# Altium schematic sheet Schematic.SchDoc
size A0; SheetNumber: 1; SheetTotal: 1
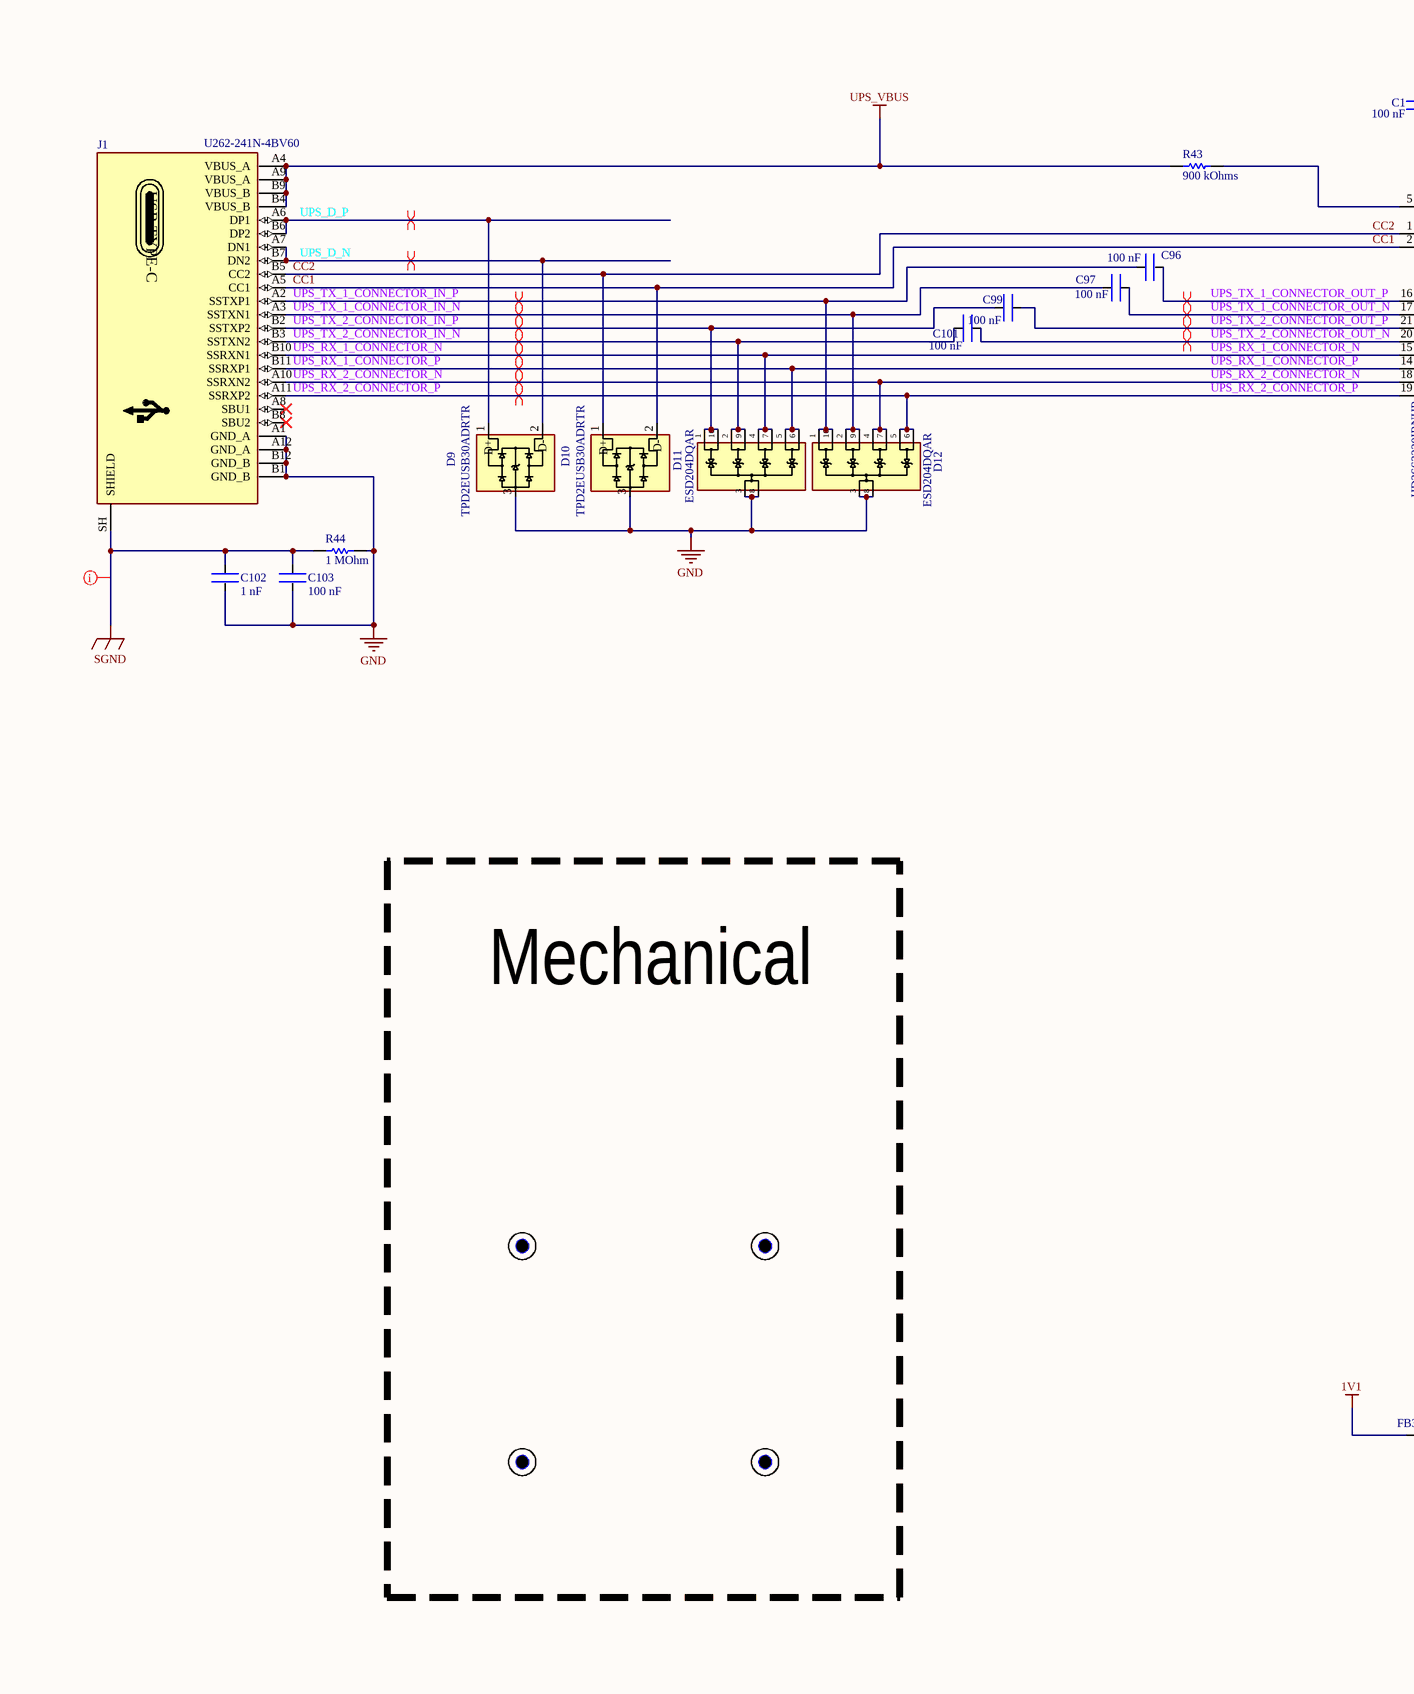
[diagram p0: Schematic.SchDoc, top left]
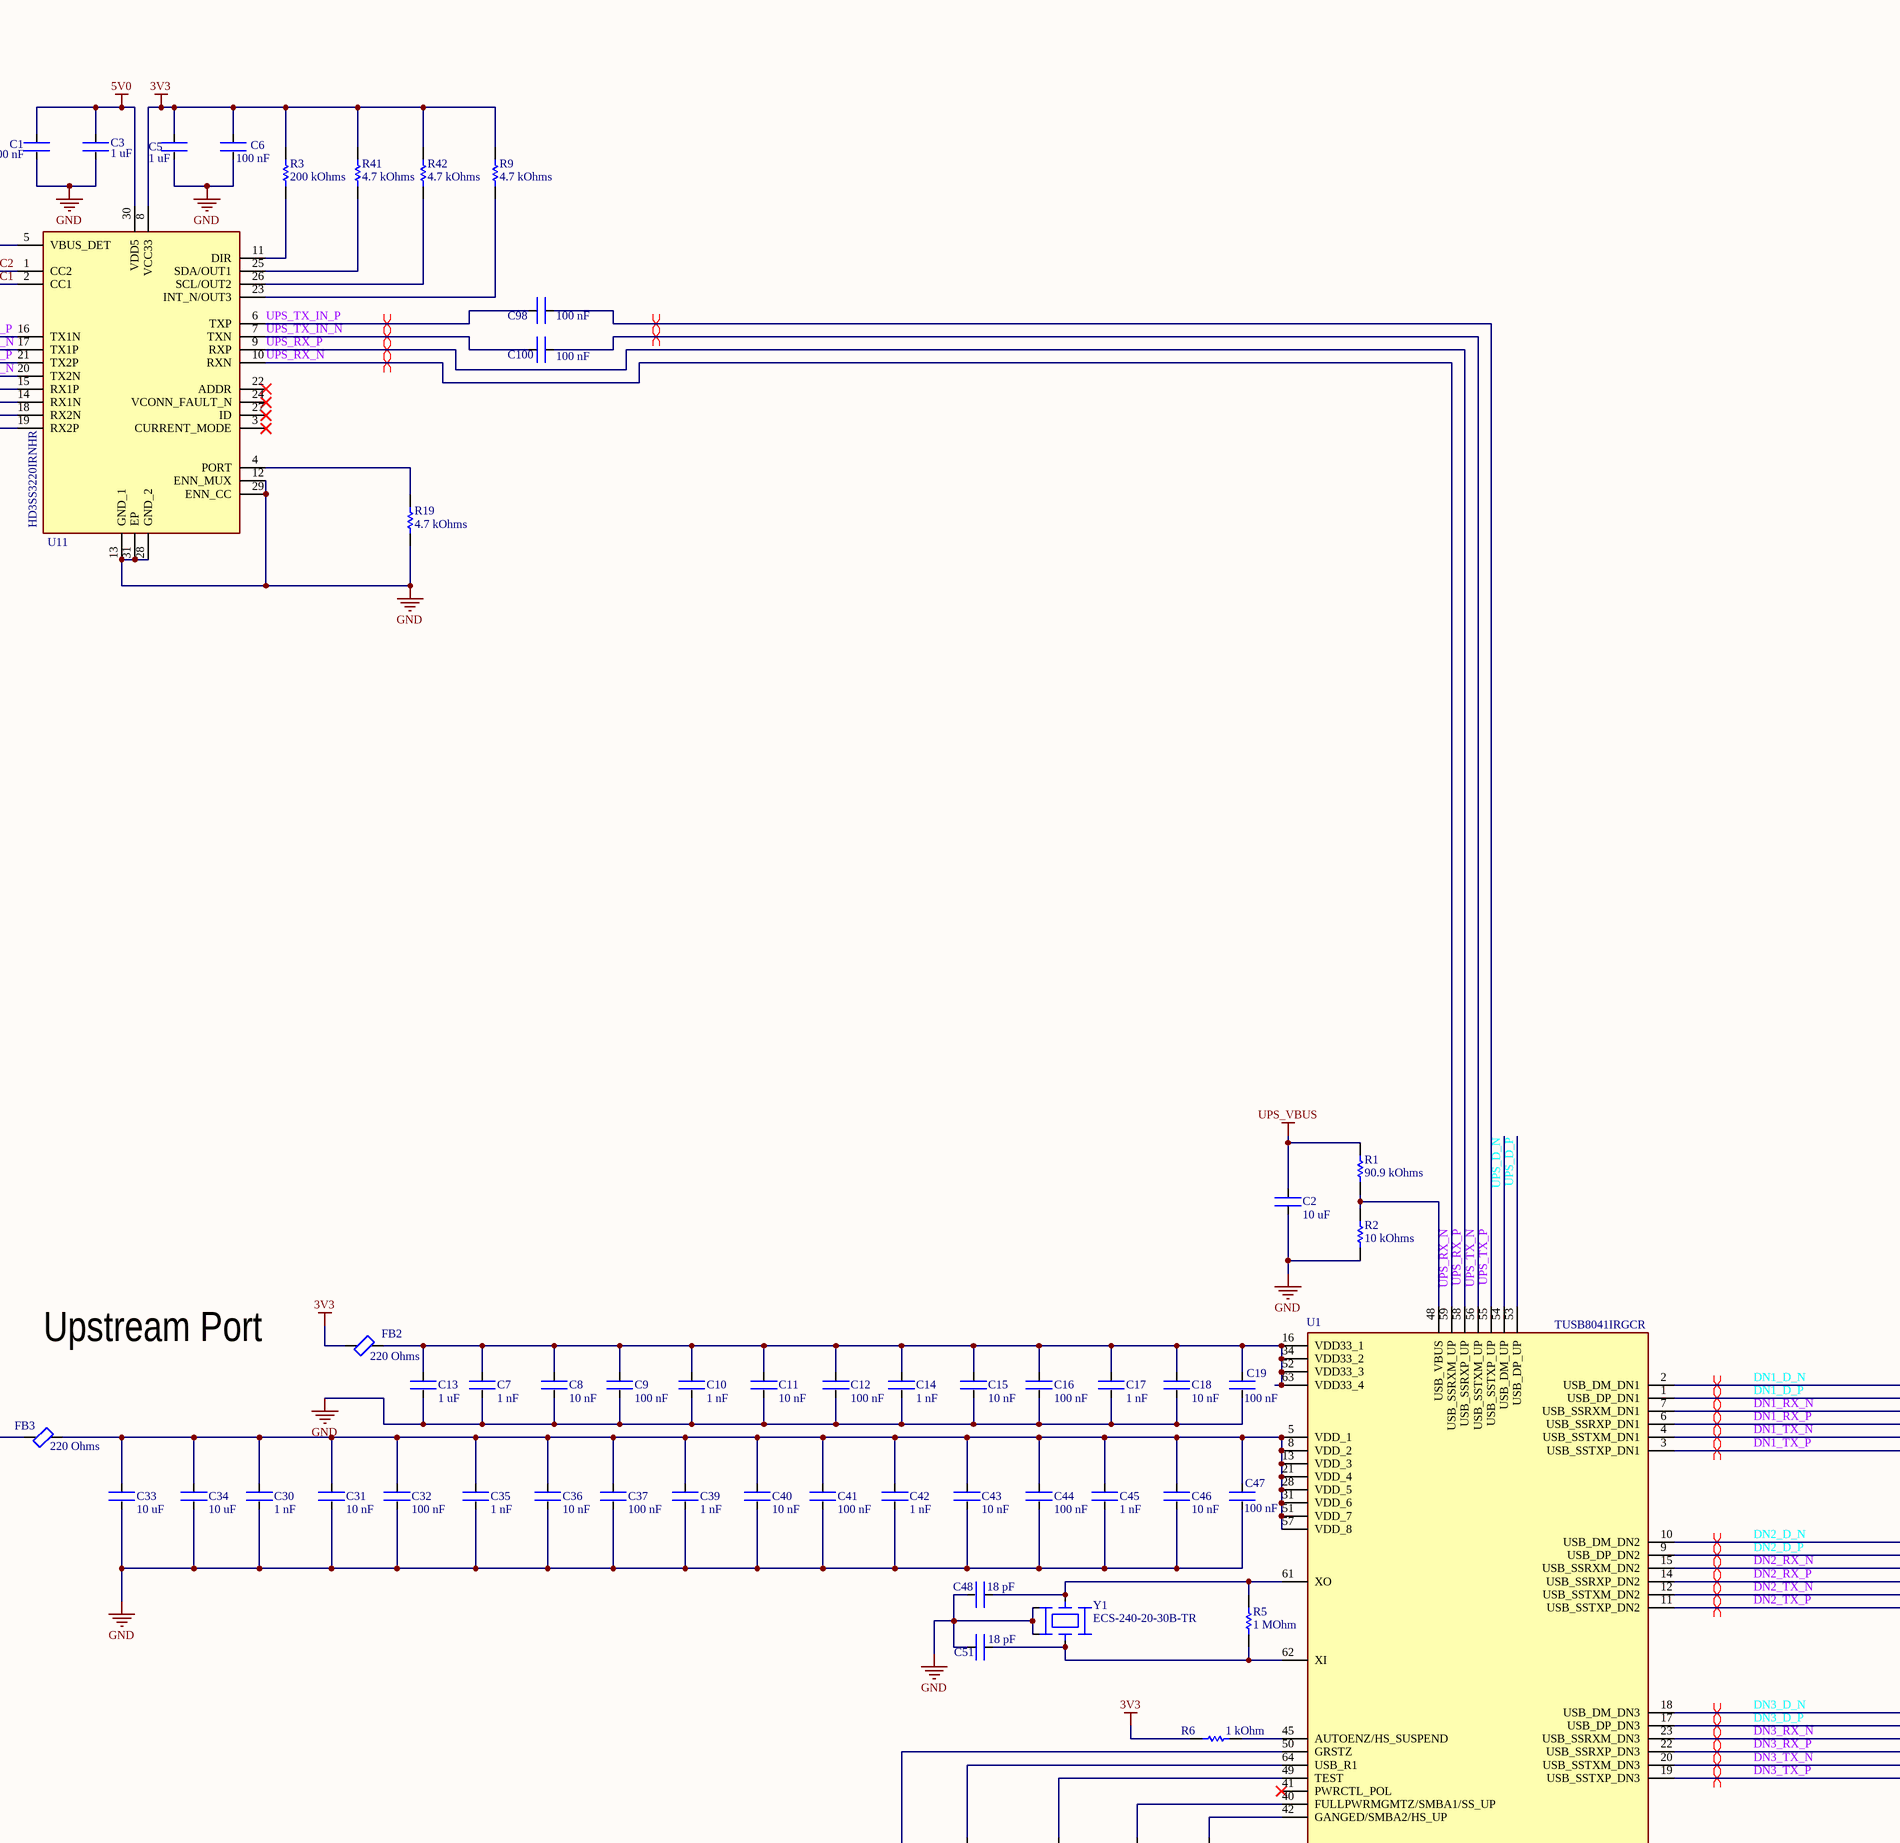
[diagram p1: Schematic.SchDoc, top middle]
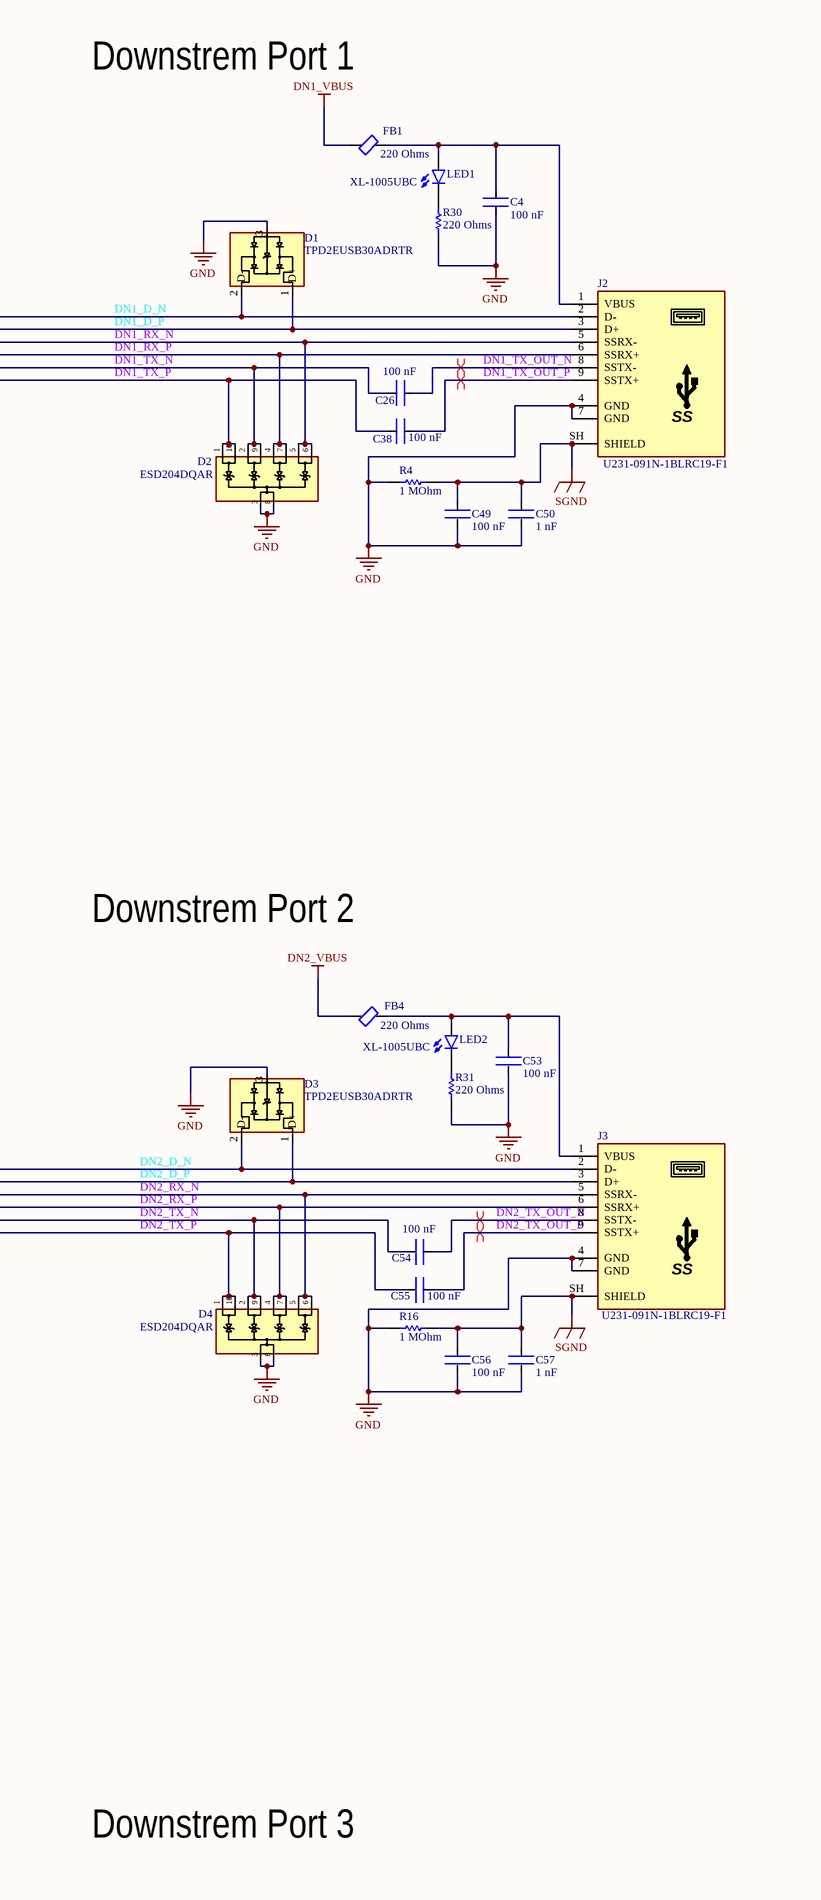
[diagram p2: Schematic.SchDoc, top right]
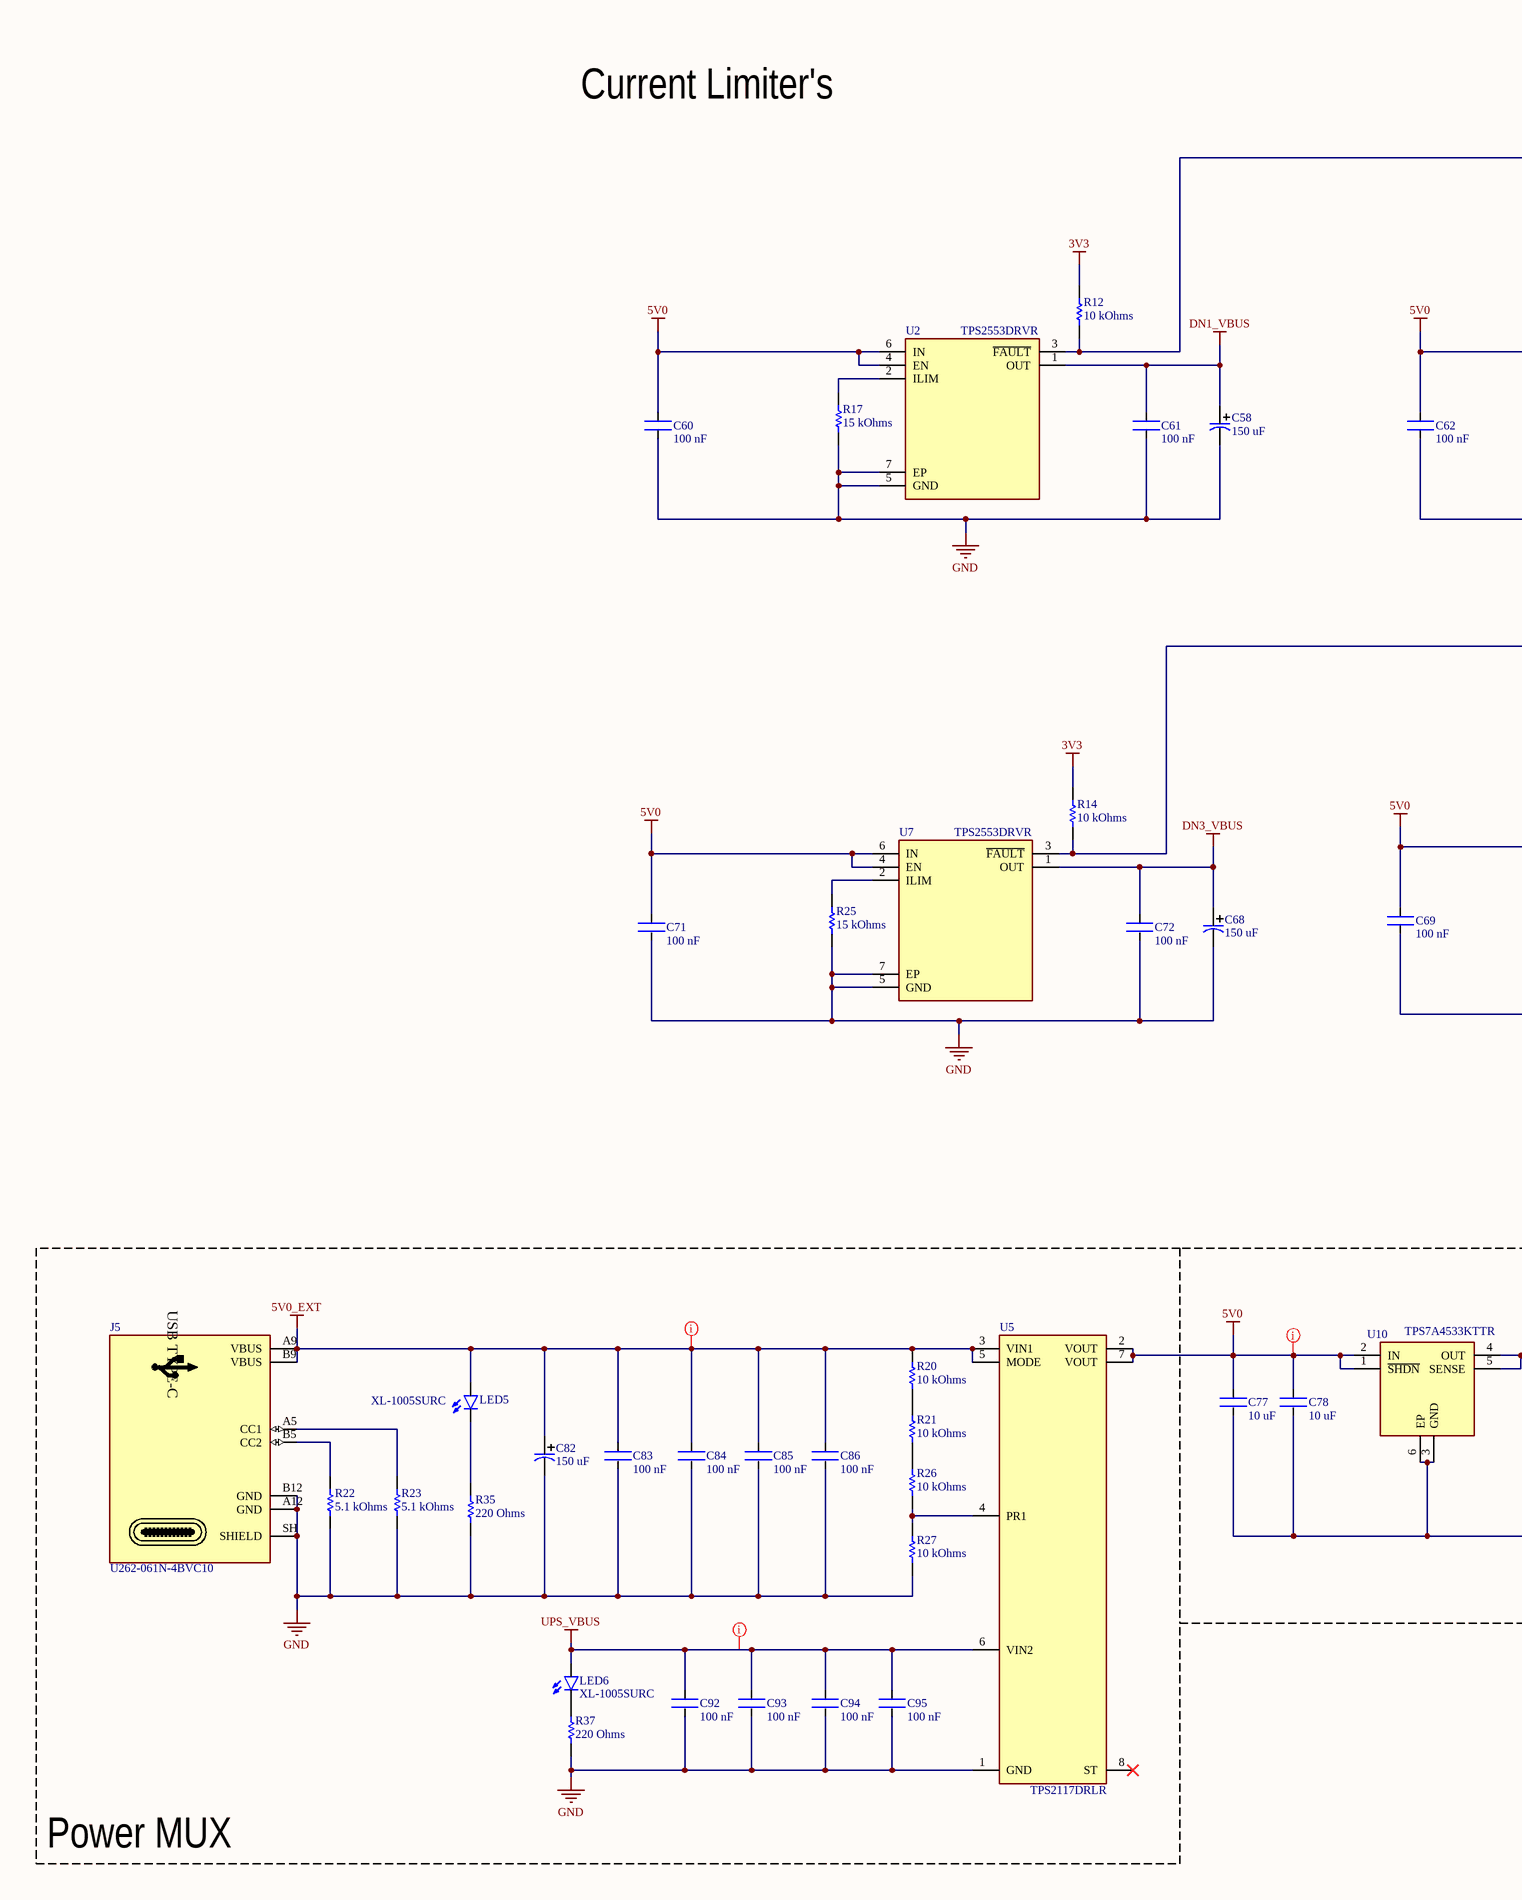
[diagram p3: Schematic.SchDoc, bottom left]
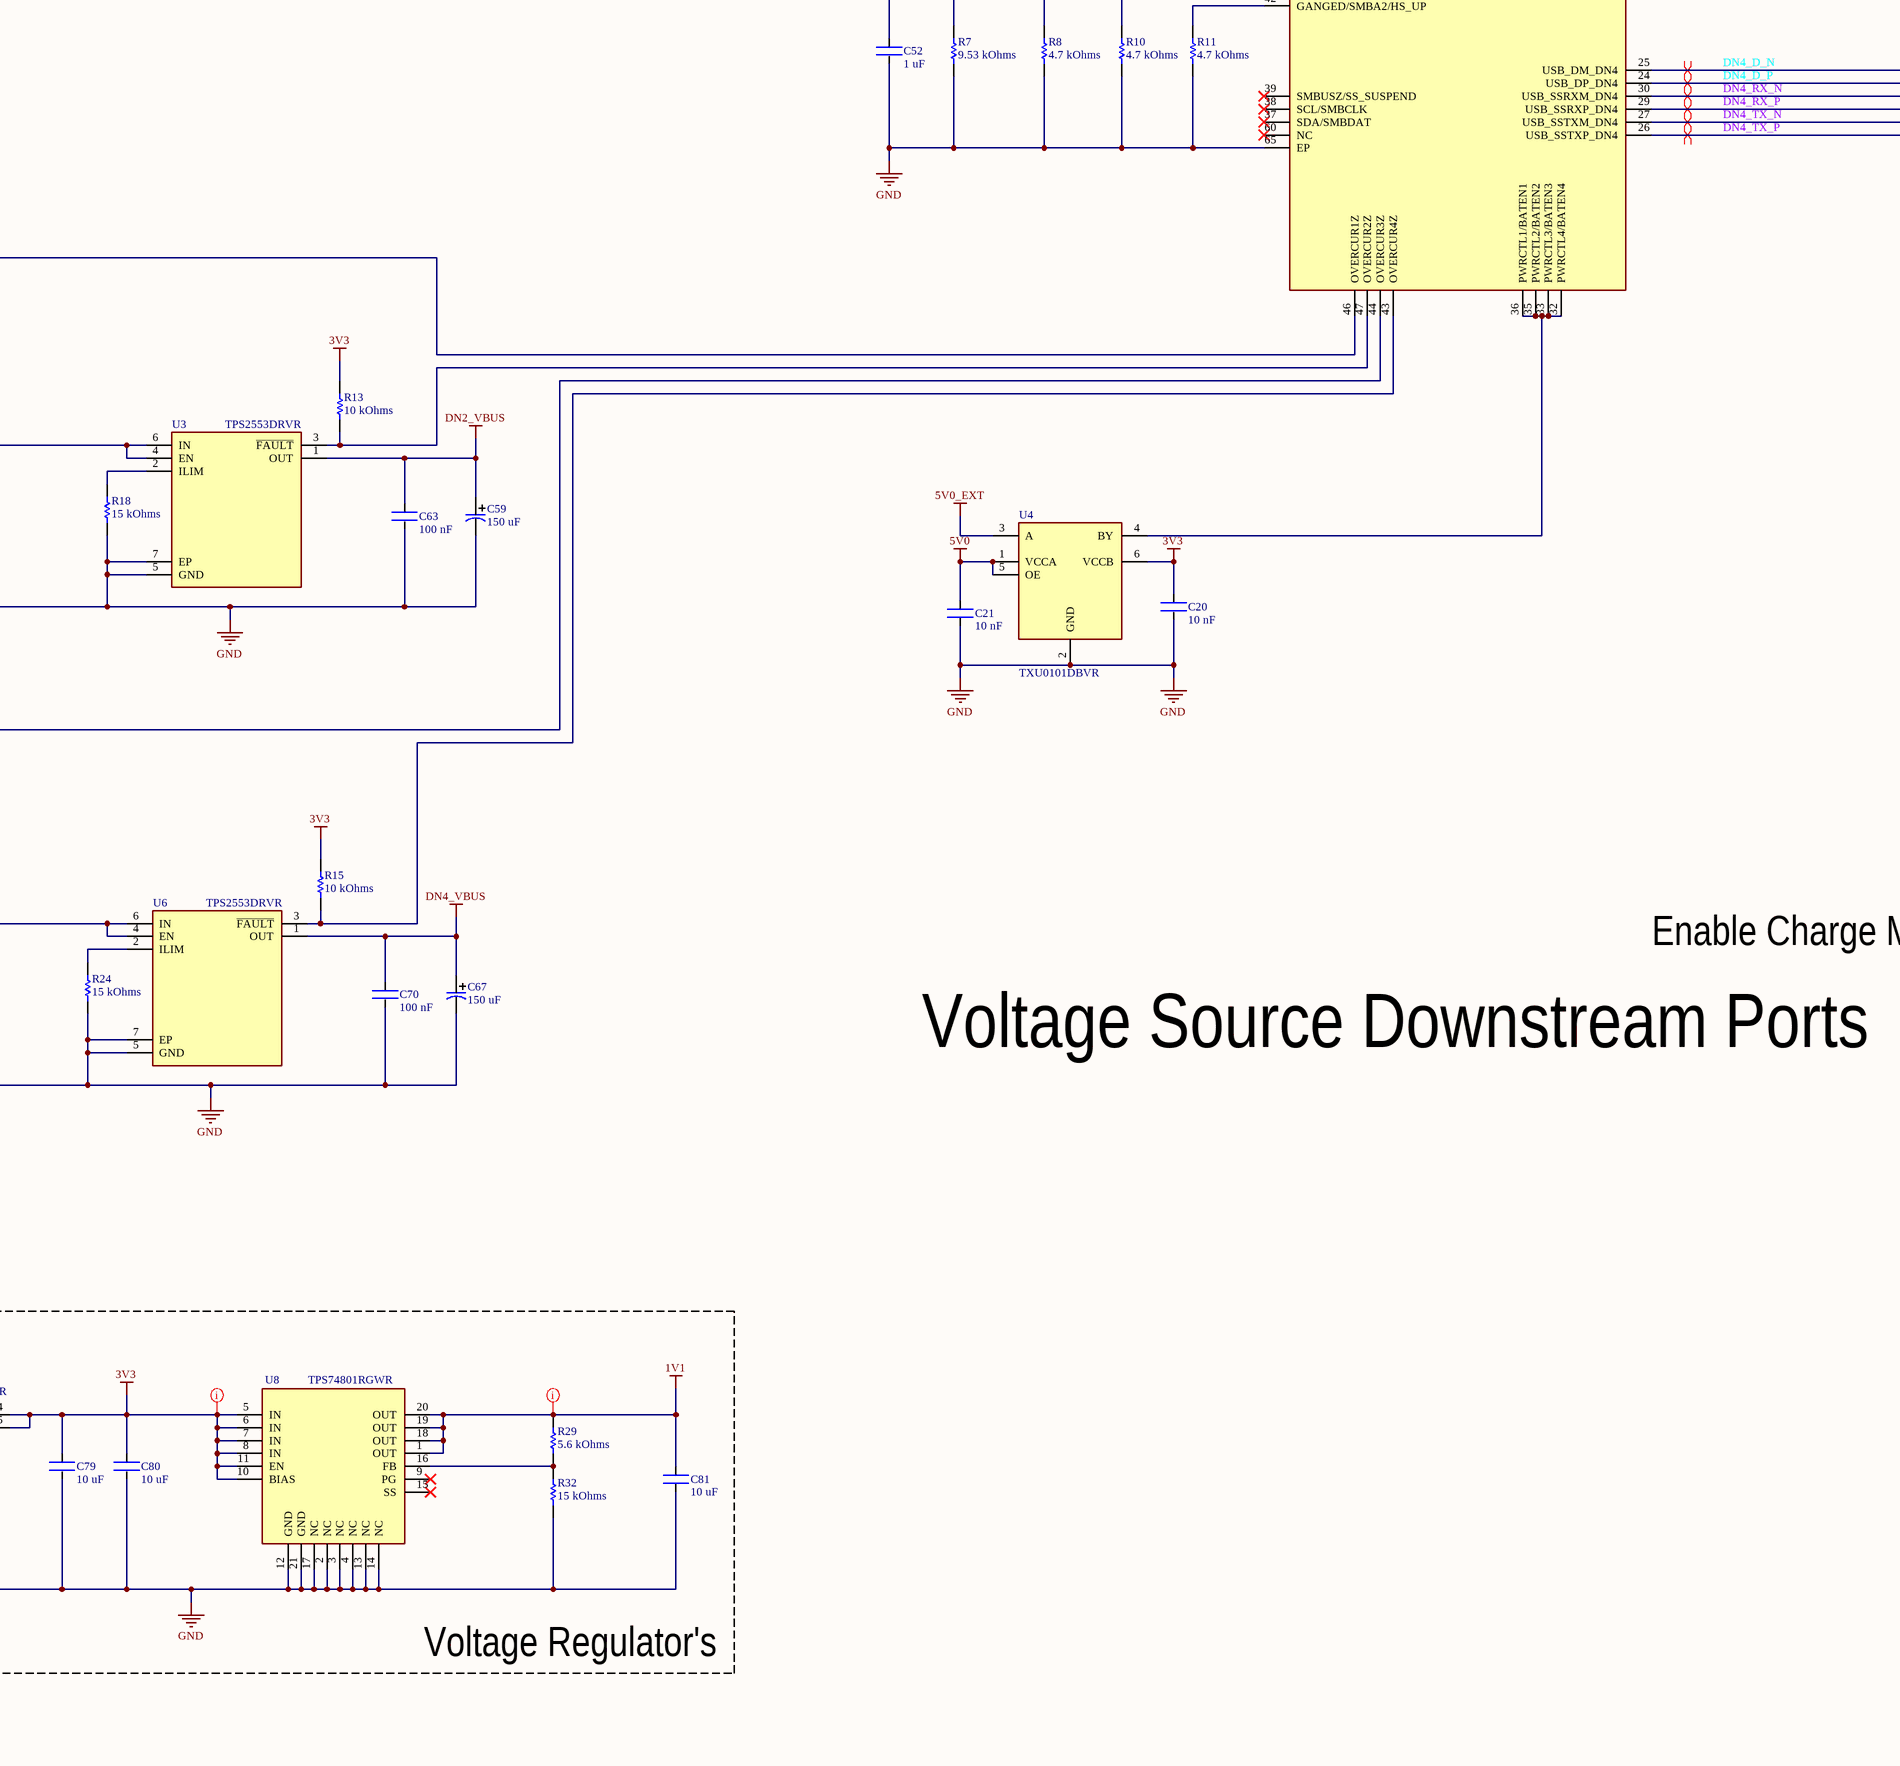
[diagram p4: Schematic.SchDoc, bottom middle]
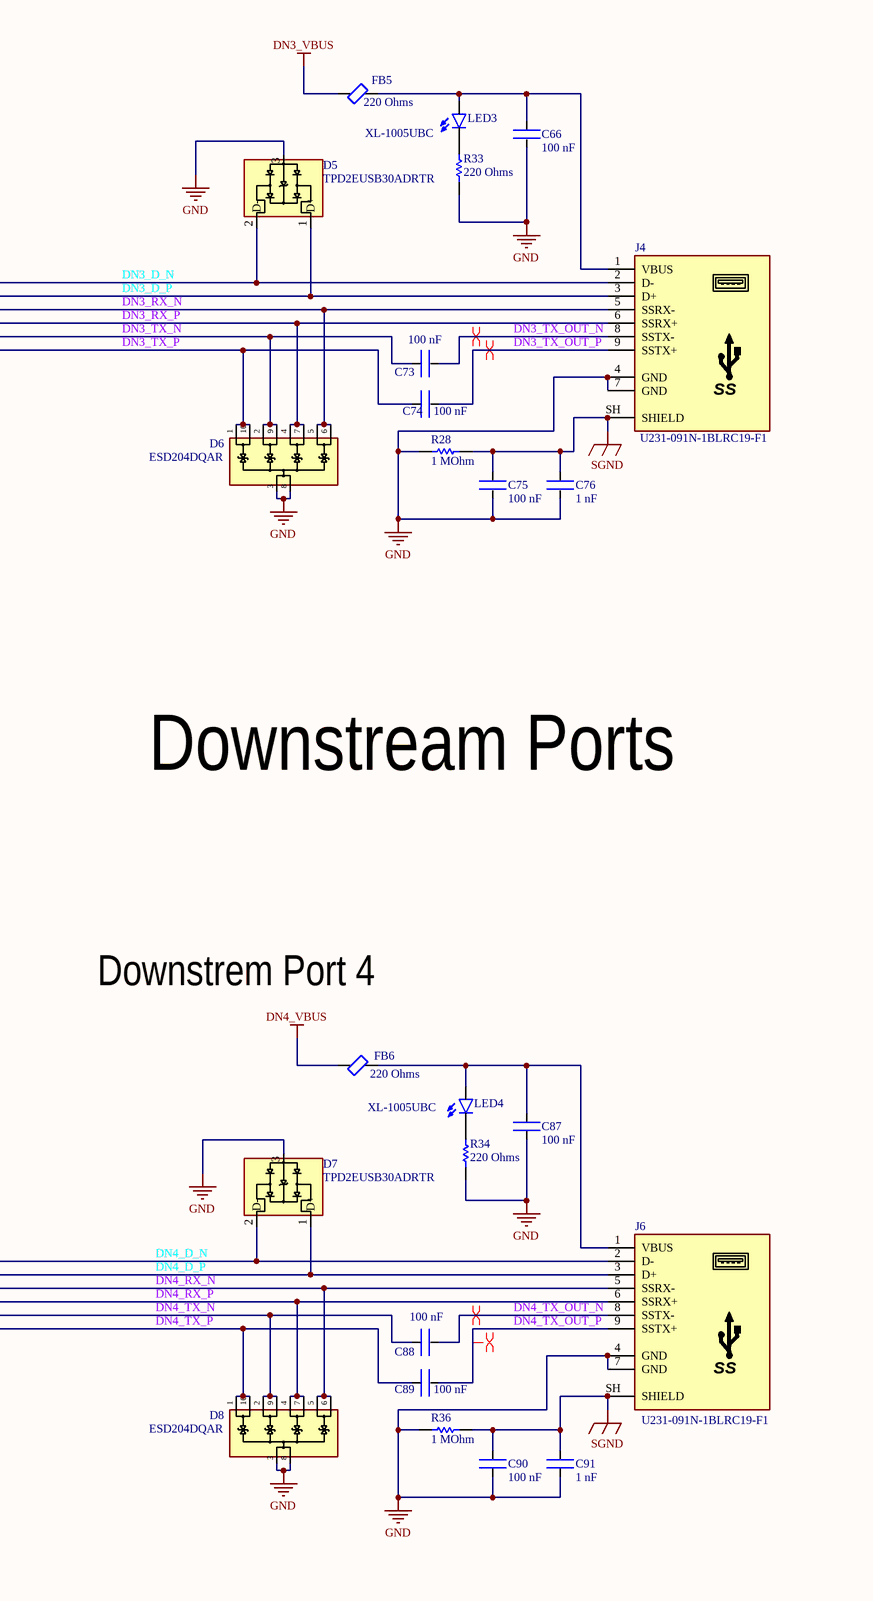
[diagram p5: Schematic.SchDoc, bottom right]

## Parts
1  Furo  [FURO_M2_DIN7985]  (value not drawn)  (no BOM)
2  Furo  [FURO_M2_DIN7985]  (value not drawn)  (no BOM)
3  Furo  [FURO_M2_DIN7985]  (value not drawn)  (no BOM)
4  Furo  [FURO_M2_DIN7985]  (value not drawn)  (no BOM)
C1  value 100 nF  [0402]  (hidden comment: CAPNPOL)
C2  value 10 uF  [0402]  (hidden comment: CAPNPOL)
C3  value 1 uF  [0402]  (hidden comment: CAPNPOL)
C4  value 100 nF  [0402]  (hidden comment: CAPNPOL)
C5  value 1 uF  [0402]  (hidden comment: CAPNPOL)
C6  value 100 nF  [0402]  (hidden comment: CAPNPOL)
C7  value 1 nF  [0402]  (hidden comment: CAPNPOL)
C8  value 10 nF  [0402]  (hidden comment: CAPNPOL)
C9  value 100 nF  [0402]  (hidden comment: CAPNPOL)
C10  value 1 nF  [0402]  (hidden comment: CAPNPOL)
C11  value 10 nF  [0402]  (hidden comment: CAPNPOL)
C12  value 100 nF  [0402]  (hidden comment: CAPNPOL)
C13  value 1 uF  [0402]  (hidden comment: CAPNPOL)
C14  value 1 nF  [0402]  (hidden comment: CAPNPOL)
C15  value 10 nF  [0402]  (hidden comment: CAPNPOL)
C16  value 100 nF  [0402]  (hidden comment: CAPNPOL)
C17  value 1 nF  [0402]  (hidden comment: CAPNPOL)
C18  value 10 nF  [0402]  (hidden comment: CAPNPOL)
C19  value 100 nF  [0402]  (hidden comment: CAPNPOL)
C20  value 10 nF  [0402]  (hidden comment: CAPNPOL)
C21  value 10 nF  [0402]  (hidden comment: CAPNPOL)
C26  value 100 nF  [0201]  (hidden comment: CAPNPOL)
C30  value 1 nF  [0402]  (hidden comment: CAPNPOL)
C31  value 10 nF  [0402]  (hidden comment: CAPNPOL)
C32  value 100 nF  [0402]  (hidden comment: CAPNPOL)
C33  value 10 uF  [0402]  (hidden comment: CAPNPOL)
C34  value 10 uF  [0402]  (hidden comment: CAPNPOL)
C35  value 1 nF  [0402]  (hidden comment: CAPNPOL)
C36  value 10 nF  [0402]  (hidden comment: CAPNPOL)
C37  value 100 nF  [0402]  (hidden comment: CAPNPOL)
C38  value 100 nF  [0201]  (hidden comment: CAPNPOL)
C39  value 1 nF  [0402]  (hidden comment: CAPNPOL)
C40  value 10 nF  [0402]  (hidden comment: CAPNPOL)
C41  value 100 nF  [0402]  (hidden comment: CAPNPOL)
C42  value 1 nF  [0402]  (hidden comment: CAPNPOL)
C43  value 10 nF  [0402]  (hidden comment: CAPNPOL)
C44  value 100 nF  [0402]  (hidden comment: CAPNPOL)
C45  value 1 nF  [0402]  (hidden comment: CAPNPOL)
C46  value 10 nF  [0402]  (hidden comment: CAPNPOL)
C47  value 100 nF  [0402]  (hidden comment: CAPNPOL)
C48  value 18 pF  [0402]  (hidden comment: CAPNPOL)
C49  value 100 nF  [0402]  (hidden comment: CAPNPOL)
C50  value 1 nF  [0402]  (hidden comment: CAPNPOL)
C51  value 18 pF  [0402]  (hidden comment: CAPNPOL)
C52  value 1 uF  [0402]  (hidden comment: CAPNPOL)
C53  value 100 nF  [0402]  (hidden comment: CAPNPOL)
C54  value 100 nF  [0201]  (hidden comment: CAPNPOL)
C55  value 100 nF  [0201]  (hidden comment: CAPNPOL)
C56  value 100 nF  [0402]  (hidden comment: CAPNPOL)
C57  value 1 nF  [0402]  (hidden comment: CAPNPOL)
C58  value 150 uF  [A-3216-18]  (hidden comment: CAPPOL)
C59  value 150 uF  [A-3216-18]  (hidden comment: CAPPOL)
C60  value 100 nF  [0402]  (hidden comment: CAPNPOL)
C61  value 100 nF  [0402]  (hidden comment: CAPNPOL)
C62  value 100 nF  [0402]  (hidden comment: CAPNPOL)
C63  value 100 nF  [0402]  (hidden comment: CAPNPOL)
C66  value 100 nF  [0402]  (hidden comment: CAPNPOL)
C67  value 150 uF  [A-3216-18]  (hidden comment: CAPPOL)
C68  value 150 uF  [A-3216-18]  (hidden comment: CAPPOL)
C69  value 100 nF  [0402]  (hidden comment: CAPNPOL)
C70  value 100 nF  [0402]  (hidden comment: CAPNPOL)
C71  value 100 nF  [0402]  (hidden comment: CAPNPOL)
C72  value 100 nF  [0402]  (hidden comment: CAPNPOL)
C73  value 100 nF  [0201]  (hidden comment: CAPNPOL)
C74  value 100 nF  [0201]  (hidden comment: CAPNPOL)
C75  value 100 nF  [0402]  (hidden comment: CAPNPOL)
C76  value 1 nF  [0402]  (hidden comment: CAPNPOL)
C77  value 10 uF  [0402]  (hidden comment: CAPNPOL)
C78  value 10 uF  [0402]  (hidden comment: CAPNPOL)
C79  value 10 uF  [0402]  (hidden comment: CAPNPOL)
C80  value 10 uF  [0402]  (hidden comment: CAPNPOL)
C81  value 10 uF  [0402]  (hidden comment: CAPNPOL)
C82  value 150 uF  [A-3216-18]  (hidden comment: CAPPOL)
C83  value 100 nF  [0402]  (hidden comment: CAPNPOL)
C84  value 100 nF  [0402]  (hidden comment: CAPNPOL)
C85  value 100 nF  [0402]  (hidden comment: CAPNPOL)
C86  value 100 nF  [0402]  (hidden comment: CAPNPOL)
C87  value 100 nF  [0402]  (hidden comment: CAPNPOL)
C88  value 100 nF  [0201]  (hidden comment: CAPNPOL)
C89  value 100 nF  [0201]  (hidden comment: CAPNPOL)
C90  value 100 nF  [0402]  (hidden comment: CAPNPOL)
C91  value 1 nF  [0402]  (hidden comment: CAPNPOL)
C92  value 100 nF  [0402]  (hidden comment: CAPNPOL)
C93  value 100 nF  [0402]  (hidden comment: CAPNPOL)
C94  value 100 nF  [0402]  (hidden comment: CAPNPOL)
C95  value 100 nF  [0402]  (hidden comment: CAPNPOL)
C96  value 100 nF  [0201]  (hidden comment: CAPNPOL)
C97  value 100 nF  [0201]  (hidden comment: CAPNPOL)
C98  value 100 nF  [0201]  (hidden comment: CAPNPOL)
C99  value 100 nF  [0201]  (hidden comment: CAPNPOL)
C100  value 100 nF  [0201]  (hidden comment: CAPNPOL)
C101  value 100 nF  [0201]  (hidden comment: CAPNPOL)
C102  value 1 nF  [0402]  (hidden comment: CAPNPOL)
C103  value 100 nF  [0402]  (hidden comment: CAPNPOL)
D1  Nome: TPD2EUSB30ADRTR  [DRT_(R-PDSO-N3)]  (hidden comment: TPD2EUSB30)
D2  ESD204DQAR  [DQA0010A]
D3  Nome: TPD2EUSB30ADRTR  [DRT_(R-PDSO-N3)]  (hidden comment: TPD2EUSB30)
D4  ESD204DQAR  [DQA0010A]
D5  Nome: TPD2EUSB30ADRTR  [DRT_(R-PDSO-N3)]  (hidden comment: TPD2EUSB30)
D6  ESD204DQAR  [DQA0010A]
D7  Nome: TPD2EUSB30ADRTR  [DRT_(R-PDSO-N3)]  (hidden comment: TPD2EUSB30)
D8  ESD204DQAR  [DQA0010A]
D9  Nome: TPD2EUSB30ADRTR  [DRT_(R-PDSO-N3)]  (hidden comment: TPD2EUSB30)
D10  Nome: TPD2EUSB30ADRTR  [DRT_(R-PDSO-N3)]  (hidden comment: TPD2EUSB30)
D11  ESD204DQAR  [DQA0010A]
D12  ESD204DQAR  [DQA0010A]
FB1  imepdancia: 220 Ohms  [FB0603]  (hidden comment: FerriteBead)
FB2  imepdancia: 220 Ohms  [FB0603]  (hidden comment: FerriteBead)
FB3  imepdancia: 220 Ohms  [FB0603]  (hidden comment: FerriteBead)
FB4  imepdancia: 220 Ohms  [FB0603]  (hidden comment: FerriteBead)
FB5  imepdancia: 220 Ohms  [FB0603]  (hidden comment: FerriteBead)
FB6  imepdancia: 220 Ohms  [FB0603]  (hidden comment: FerriteBead)
J1  U262-241N-4BV60  [U262-241N-4BV60]
J2  U231-091N-1BLRC19-F1  [U231-091N-1BLRC19-F1]
J3  U231-091N-1BLRC19-F1  [U231-091N-1BLRC19-F1]
J4  U231-091N-1BLRC19-F1  [U231-091N-1BLRC19-F1]
J5  U262-061N-4BVC10  [U262-061N-4BVC10]
J6  U231-091N-1BLRC19-F1  [U231-091N-1BLRC19-F1]
LED1  Nome: XL-1005UBC  [0402]  (hidden comment: LED)
LED2  Nome: XL-1005UBC  [0402]  (hidden comment: LED)
LED3  Nome: XL-1005UBC  [0402]  (hidden comment: LED)
LED4  Nome: XL-1005UBC  [0402]  (hidden comment: LED)
LED5  Nome: XL-1005SURC  [0402]  (hidden comment: LED)
LED6  Nome: XL-1005SURC  [0402]  (hidden comment: LED)
R1  value 90.9 kOhms  [R0402]  (hidden comment: Resistor)
R2  value 10 kOhms  [R0402]  (hidden comment: Resistor)
R3  value 200 kOhms  [R0402]  (hidden comment: Resistor)
R4  value 1 MOhm  [R0402]  (hidden comment: Resistor)
R5  value 1 MOhm  [R0402]  (hidden comment: Resistor)
R6  value 1 kOhm  [R0402]  (hidden comment: Resistor)
R7  value 9.53 kOhms  [R0402]  (hidden comment: Resistor)
R8  value 4.7 kOhms  [R0402]  (hidden comment: Resistor)
R9  value 4.7 kOhms  [R0402]  (hidden comment: Resistor)
R10  value 4.7 kOhms  [R0402]  (hidden comment: Resistor)
R11  value 4.7 kOhms  [R0402]  (hidden comment: Resistor)
R12  value 10 kOhms  [R0402]  (hidden comment: Resistor)
R13  value 10 kOhms  [R0402]  (hidden comment: Resistor)
R14  value 10 kOhms  [R0402]  (hidden comment: Resistor)
R15  value 10 kOhms  [R0402]  (hidden comment: Resistor)
R16  value 1 MOhm  [R0402]  (hidden comment: Resistor)
R17  value 15 kOhms  [R0402]  (hidden comment: Resistor)
R18  value 15 kOhms  [R0402]  (hidden comment: Resistor)
R19  value 4.7 kOhms  [R0402]  (hidden comment: Resistor)
R20  value 10 kOhms  [R0402]  (hidden comment: Resistor)
R21  value 10 kOhms  [R0402]  (hidden comment: Resistor)
R22  value 5.1 kOhms  [R0402]  (hidden comment: Resistor)
R23  value 5.1 kOhms  [R0402]  (hidden comment: Resistor)
R24  value 15 kOhms  [R0402]  (hidden comment: Resistor)
R25  value 15 kOhms  [R0402]  (hidden comment: Resistor)
R26  value 10 kOhms  [R0402]  (hidden comment: Resistor)
R27  value 10 kOhms  [R0402]  (hidden comment: Resistor)
R28  value 1 MOhm  [R0402]  (hidden comment: Resistor)
R29  value 5.6 kOhms  [R0402]  (hidden comment: Resistor)
R30  value 220 Ohms  [R0402]  (hidden comment: Resistor)
R31  value 220 Ohms  [R0402]  (hidden comment: Resistor)
R32  value 15 kOhms  [R0402]  (hidden comment: Resistor)
R33  value 220 Ohms  [R0402]  (hidden comment: Resistor)
R34  value 220 Ohms  [R0402]  (hidden comment: Resistor)
R35  value 220 Ohms  [R0402]  (hidden comment: Resistor)
R36  value 1 MOhm  [R0402]  (hidden comment: Resistor)
R37  value 220 Ohms  [R0402]  (hidden comment: Resistor)
R41  value 4.7 kOhms  [R0402]  (hidden comment: Resistor)
R42  value 4.7 kOhms  [R0402]  (hidden comment: Resistor)
R43  value 900 kOhms  [R0805]  (hidden comment: Resistor)
R44  value 1 MOhm  [R0402]  (hidden comment: Resistor)
U1  TUSB8041IRGCR  [RGC0064G]
U2  TPS2553DRVR  [DRV0006A]
U3  TPS2553DRVR  [DRV0006A]
U4  TXU0101DBVR  [DBV0006A]
U5  TPS2117DRLR  [DRL0008A]
U6  TPS2553DRVR  [DRV0006A]
U7  TPS2553DRVR  [DRV0006A]
U8  TPS74801RGWR  [RGW0020A]
U10  TPS7A4533KTTR  [R-PSFM-G5]
U11  HD3SS3220IRNHR  [RNH0030A]
Y1  ECS-240-20-30B-TR  [ECS-240-20-30B-TR]

## Blocks framed on the sheet
Mechanical: 1-4
Voltage Regulator's: C77-C81 R29 R32 U8 U10

## Nets
1V1: C81.1 FB3.1 R29.2 U8.1(OUT) U8.18(OUT) U8.19(OUT) U8.20(OUT)
3V3: C5.1 C6.1 C20.1 C79.1 C80.1 FB2.1 R3.2 R6.2 R9.2 R12.2 R13.2 R14.2 R15.2 R41.2 R42.2 U4.6(VCCB) U8.5(IN) U8.6(IN) U8.7(IN) U8.8(IN) U8.10(BIAS) U8.11(EN) U10.4(OUT) U10.5(SENSE) U11.8(VCC33)
5V0: C1.1 C3.1 C21.1 C60.1 C62.1 C69.1 C71.1 C77.1 C78.1 U2.4(EN) U2.6(IN) U3.4(EN) U3.6(IN) U4.1(VCCA) U4.5(OE) U5.2(VOUT) U5.7(VOUT) U6.4(EN) U6.6(IN) U7.4(EN) U7.6(IN) U10.1(~{SHDN}) U10.2(IN) U11.30(VDD5)
5V0_EXT: C82.1 C83.1 C84.1 C85.1 C86.1 J5.A9(VBUS) J5.B9(VBUS) LED5.2 R20.2 U4.3(A) U5.3(VIN1) U5.5(MODE)
DN1_VBUS: C58.1 C61.1 FB1.1 U2.1(OUT)
DN2_VBUS: C59.1 C63.1 FB4.1 U3.1(OUT)
DN3_VBUS: C68.1 C72.1 FB5.1 U7.1(OUT)
DN4_VBUS: C67.1 C70.1 FB6.1 U6.1(OUT)
GND: C1.2 C2.2 C3.2 C4.2 C5.2 C6.2 C7.2 C8.2 C9.2 C10.2 C11.2 C12.2 C13.2 C14.2 C15.2 C16.2 C17.2 C18.2 C19.2 C20.2 C21.2 C30.2 C31.2 C32.2 C33.2 C34.2 C35.2 C36.2 C37.2 C39.2 C40.2 C41.2 C42.2 C43.2 C44.2 C45.2 C46.2 C47.2 C48.2 C49.2 C50.2 C51.1 C52.2 C53.2 C56.2 C57.2 C58.2 C59.2 C60.2 C61.2 C62.2 C63.2 C66.2 C67.2 C68.2 C69.2 C70.2 C71.2 C72.2 C75.2 C76.2 C77.2 C78.2 C79.2 C80.2 C81.2 C82.2 C83.2 C84.2 C85.2 C86.2 C87.2 C90.2 C91.2 C92.2 C93.2 C94.2 C95.2 C102.2 C103.2 D1.3(GND) D2.3(GND_3) D2.8(GND_8) D3.3(GND) D4.3(GND_3) D4.8(GND_8) D5.3(GND) D6.3(GND_3) D6.8(GND_8) D7.3(GND) D8.3(GND_3) D8.8(GND_8) D9.3(GND) D10.3(GND) D11.3(GND_3) D11.8(GND_8) D12.3(GND_3) D12.8(GND_8) J1.A1(GND_A) J1.A12(GND_A) J1.B1(GND_B) J1.B12(GND_B) J2.4(GND) J2.7(GND) J3.4(GND) J3.7(GND) J4.4(GND) J5.A12(GND) J5.B12(GND) J5.SH(SHIELD) J6.4(GND) J6.7(GND) R2.1 R4.1 R7.1 R8.1 R10.1 R11.1 R16.1 R17.1 R18.1 R19.1 R22.1 R23.1 R24.1 R25.1 R27.1 R28.1 R30.1 R31.1 R32.1 R33.1 R34.1 R35.1 R36.1 R37.1 R44.2 U1.65(EP) U2.5(GND) U2.7(EP) U3.5(GND) U3.7(EP) U4.2(GND) U5.1(GND) U6.5(GND) U6.7(EP) U7.5(GND) U7.7(EP) U8.2(NC) U8.3(NC) U8.4(NC) U8.12(GND) U8.13(NC) U8.14(NC) U8.17(NC) U8.21(GND) U10.3(GND) U10.6(EP) U11.12(ENN_MUX) U11.13(GND_1) U11.28(GND_2) U11.29(ENN_CC) U11.31(EP) Y1.2 Y1.4
SGND: C49.1 C50.1 C56.1 C57.1 C75.1 C76.1 C90.1 C91.1 C102.1 C103.1 J1.SH(SHIELD) J2.SH(SHIELD) J3.SH(SHIELD) J4.SH(SHIELD) J6.SH(SHIELD) R4.2 R16.2 R28.2 R36.2 R44.1
UPS_VBUS: C2.1 C92.1 C93.1 C94.1 C95.1 J1.A4(VBUS_A) J1.A9(VBUS_A) J1.B4(VBUS_B) J1.B9(VBUS_B) LED6.2 R1.2 R43.1 U5.6(VIN2)
CC1: D10.2(D-) J1.A5(CC1) U11.2(CC1)
CC2: D10.1(D+) J1.B5(CC2) U11.1(CC2)
DN1_D_N: D1.2(D-) J2.2(D-) U1.2(USB_DM_DN1)
DN1_D_P: D1.1(D+) J2.3(D+) U1.1(USB_DP_DN1)
DN1_RX_N: D2.5(IO4) D2.6(NC_6) J2.5(SSRX-) U1.7(USB_SSRXM_DN1)
DN1_RX_P: D2.4(IO3) D2.7(NC_7) J2.6(SSRX+) U1.6(USB_SSRXP_DN1)
DN1_TX_N: C26.1 D2.2(IO2) D2.9(NC_9) U1.4(USB_SSTXM_DN1)
DN1_TX_OUT_N: C26.2 J2.8(SSTX-)
DN1_TX_OUT_P: C38.2 J2.9(SSTX+)
DN1_TX_P: C38.1 D2.1(IO1) D2.10(NC_10) U1.3(USB_SSTXP_DN1)
DN2_D_N: D3.2(D-) J3.2(D-) U1.10(USB_DM_DN2)
DN2_D_P: D3.1(D+) J3.3(D+) U1.9(USB_DP_DN2)
DN2_RX_N: D4.5(IO4) D4.6(NC_6) J3.5(SSRX-) U1.15(USB_SSRXM_DN2)
DN2_RX_P: D4.4(IO3) D4.7(NC_7) J3.6(SSRX+) U1.14(USB_SSRXP_DN2)
DN2_TX_N: C54.1 D4.2(IO2) D4.9(NC_9) U1.12(USB_SSTXM_DN2)
DN2_TX_OUT_N: C54.2 J3.8(SSTX-)
DN2_TX_OUT_P: C55.2 J3.9(SSTX+)
DN2_TX_P: C55.1 D4.1(IO1) D4.10(NC_10) U1.11(USB_SSTXP_DN2)
DN3_D_N: D5.2(D-) J4.2(D-) U1.18(USB_DM_DN3)
DN3_D_P: D5.1(D+) J4.3(D+) U1.17(USB_DP_DN3)
DN3_RX_N: D6.5(IO4) D6.6(NC_6) J4.5(SSRX-) U1.23(USB_SSRXM_DN3)
DN3_RX_P: D6.4(IO3) D6.7(NC_7) J4.6(SSRX+) U1.22(USB_SSRXP_DN3)
DN3_TX_N: C73.1 D6.2(IO2) D6.9(NC_9) U1.20(USB_SSTXM_DN3)
DN3_TX_OUT_N: C73.2 J4.8(SSTX-)
DN3_TX_OUT_P: C74.2 J4.9(SSTX+)
DN3_TX_P: C74.1 D6.1(IO1) D6.10(NC_10) U1.19(USB_SSTXP_DN3)
DN4_D_N: D7.2(D-) J6.2(D-) U1.25(USB_DM_DN4)
DN4_D_P: D7.1(D+) J6.3(D+) U1.24(USB_DP_DN4)
DN4_RX_N: D8.5(IO4) D8.6(NC_6) J6.5(SSRX-) U1.30(USB_SSRXM_DN4)
DN4_RX_P: D8.4(IO3) D8.7(NC_7) J6.6(SSRX+) U1.29(USB_SSRXP_DN4)
DN4_TX_N: C88.1 D8.2(IO2) D8.9(NC_9) U1.27(USB_SSTXM_DN4)
DN4_TX_OUT_N: C88.2 J6.8(SSTX-)
DN4_TX_OUT_P: C89.2 J6.9(SSTX+)
DN4_TX_P: C89.1 D8.1(IO1) D8.10(NC_10) U1.26(USB_SSTXP_DN4)
UPS_D_N: D9.2(D-) J1.A7(DN1) J1.B7(DN2) U1.54(USB_DM_UP)
UPS_D_P: D9.1(D+) J1.A6(DP1) J1.B6(DP2) U1.53(USB_DP_UP)
UPS_RX_1_CONNECTOR_N: D11.4(IO3) D11.7(NC_7) J1.B10(SSRXN1) U11.15(RX1P)
UPS_RX_1_CONNECTOR_P: D11.5(IO4) D11.6(NC_6) J1.B11(SSRXP1) U11.14(RX1N)
UPS_RX_2_CONNECTOR_N: D12.4(IO3) D12.7(NC_7) J1.A10(SSRXN2) U11.18(RX2N)
UPS_RX_2_CONNECTOR_P: D12.5(IO4) D12.6(NC_6) J1.A11(SSRXP2) U11.19(RX2P)
UPS_RX_N: U1.59(USB_SSRXM_UP) U11.10(RXN)
UPS_RX_P: U1.58(USB_SSRXP_UP) U11.9(RXP)
UPS_TX_1_CONNECTOR_IN_N: C97.1 D12.2(IO2) D12.9(NC_9) J1.A3(SSTXN1)
UPS_TX_1_CONNECTOR_IN_P: C96.1 D12.1(IO1) D12.10(NC_10) J1.A2(SSTXP1)
UPS_TX_1_CONNECTOR_OUT_N: C97.2 U11.17(TX1P)
UPS_TX_1_CONNECTOR_OUT_P: C96.2 U11.16(TX1N)
UPS_TX_2_CONNECTOR_IN_N: C101.1 D11.2(IO2) D11.9(NC_9) J1.B3(SSTXN2)
UPS_TX_2_CONNECTOR_IN_P: C99.1 D11.1(IO1) D11.10(NC_10) J1.B2(SSTXP2)
UPS_TX_2_CONNECTOR_OUT_N: C101.2 U11.20(TX2N)
UPS_TX_2_CONNECTOR_OUT_P: C99.2 U11.21(TX2P)
UPS_TX_IN_N: C100.1 U11.7(TXN)
UPS_TX_IN_P: C98.1 U11.6(TXP)
UPS_TX_N: C100.2 U1.56(USB_SSTXM_UP)
UPS_TX_P: C98.2 U1.55(USB_SSTXP_UP)
NetC4_1: C4.1 FB1.2 J2.1(VBUS) LED1.2
NetC7_1: C7.1 C8.1 C9.1 C10.1 C11.1 C12.1 C13.1 C14.1 C15.1 C16.1 C17.1 C18.1 C19.1 FB2.2 U1.16(VDD33_1) U1.34(VDD33_2) U1.52(VDD33_3) U1.63(VDD33_4)
NetC30_1: C30.1 C31.1 C32.1 C33.1 C34.1 C35.1 C36.1 C37.1 C39.1 C40.1 C41.1 C42.1 C43.1 C44.1 C45.1 C46.1 C47.1 FB3.2 U1.5(VDD_1) U1.8(VDD_2) U1.13(VDD_3) U1.21(VDD_4) U1.28(VDD_5) U1.31(VDD_6) U1.51(VDD_7) U1.57(VDD_8)
NetC48_1: C48.1 R5.2 U1.61(XO) Y1.1
NetC51_2: C51.2 R5.1 U1.62(XI) Y1.3
NetC52_1: C52.1 U1.50(GRSTZ)
NetC53_1: C53.1 FB4.2 J3.1(VBUS) LED2.2
NetC66_1: C66.1 FB5.2 J4.1(VBUS) LED3.2
NetC87_1: C87.1 FB6.2 J6.1(VBUS) LED4.2
NetJ5_A5: J5.A5(CC1) R23.2
NetJ5_B5: J5.B5(CC2) R22.2
NetLED1_1: LED1.1 R30.2
NetLED2_1: LED2.1 R31.2
NetLED3_1: LED3.1 R33.2
NetLED4_1: LED4.1 R34.2
NetLED5_1: LED5.1 R35.2
NetLED6_1: LED6.1 R37.2
NetR1_1: R1.1 R2.2 U1.48(USB_VBUS)
NetR3_1: R3.1 U11.11(DIR)
NetR6_1: R6.1 U1.45(AUTOENZ/HS_SUSPEND)
NetR7_2: R7.2 U1.64(USB_R1)
NetR8_2: R8.2 U1.49(TEST)
NetR9_1: R9.1 U11.23(INT_N/OUT3)
NetR10_2: R10.2 U1.40(FULLPWRMGMTZ/SMBA1/SS_UP)
NetR11_2: R11.2 U1.42(GANGED/SMBA2/HS_UP)
NetR12_1: R12.1 U1.46(OVERCUR1Z) U2.3(~{FAULT})
NetR13_1: R13.1 U1.47(OVERCUR2Z) U3.3(~{FAULT})
NetR14_1: R14.1 U1.44(OVERCUR3Z) U7.3(~{FAULT})
NetR15_1: R15.1 U1.43(OVERCUR4Z) U6.3(~{FAULT})
NetR17_2: R17.2 U2.2(ILIM)
NetR18_2: R18.2 U3.2(ILIM)
NetR19_2: R19.2 U11.4(PORT)
NetR20_1: R20.1 R21.2
NetR21_1: R21.1 R26.2
NetR24_2: R24.2 U6.2(ILIM)
NetR25_2: R25.2 U7.2(ILIM)
NetR26_1: R26.1 R27.2 U5.4(PR1)
NetR29_1: R29.1 R32.2 U8.16(FB)
NetR41_1: R41.1 U11.25(SDA/OUT1)
NetR42_1: R42.1 U11.26(SCL/OUT2)
NetR43_2: R43.2 U11.5(VBUS_DET)
NetU1_32: U1.32(PWRCTL4/BATEN4) U1.33(PWRCTL3/BATEN3) U1.35(PWRCTL2/BATEN2) U1.36(PWRCTL1/BATEN1) U4.4(BY)

Not connected (* = marked no-connect by the designer): J1 A8(SBU1)* B8(SBU2)*; J4 7(GND); U1 37(SDA/SMBDAT)* 38(SCL/SMBCLK)* 39(SMBUSZ/SS_SUSPEND)* 41(PWRCTL_POL)* 60(NC)*; U5 8(ST)*; U8 9(PG)* 15(SS)*; U11 3(CURRENT_MODE)* 22(ADDR)* 24(VCONN_FAULT_N)* 27(ID)*

## Layout directives
differential pair: DN1_D_N, DN1_D_P, DN1_RX_N, DN1_RX_P, DN1_TX_N, DN1_TX_OUT_N, DN1_TX_OUT_P, DN1_TX_P, DN2_D_N, DN2_D_P, DN2_RX_N, DN2_RX_P, DN2_TX_N, DN2_TX_OUT_N, DN2_TX_OUT_P, DN2_TX_P, DN3_D_N, DN3_D_P, DN3_RX_N, DN3_RX_P, DN3_TX_N, DN3_TX_OUT_N, DN3_TX_OUT_P, DN3_TX_P, DN4_D_N, DN4_D_P, DN4_RX_N, DN4_RX_P, DN4_TX_N, DN4_TX_OUT_N, DN4_TX_OUT_P, DN4_TX_P, UPS_D_N, UPS_D_P, UPS_RX_1_CONNECTOR_N, UPS_RX_1_CONNECTOR_P, UPS_RX_2_CONNECTOR_N, UPS_RX_2_CONNECTOR_P, UPS_RX_N, UPS_RX_P, UPS_TX_1_CONNECTOR_IN_N, UPS_TX_1_CONNECTOR_IN_P, UPS_TX_1_CONNECTOR_OUT_N, UPS_TX_1_CONNECTOR_OUT_P, UPS_TX_2_CONNECTOR_IN_N, UPS_TX_2_CONNECTOR_IN_P, UPS_TX_2_CONNECTOR_OUT_N, UPS_TX_2_CONNECTOR_OUT_P, UPS_TX_IN_N, UPS_TX_IN_P, UPS_TX_N, UPS_TX_P
net class PowerNets: 1V1, 3V3, 5V0, 5V0_EXT, SGND, UPS_VBUS

## Notes on the sheet
- Downstrem Port 1
- Downstrem Port 2
- (near FB2) Upstream Port
- Downstrem Port 3
- Current Limiter's
- Downstream Ports
- Enable Charge Mode Logic
- Downstrem Port 4
- Voltage Source Downstream Ports
- Power MUX
- TYPE DOC:
- DOC NO:
- PART NO:
- PROJECT OPEN SOURCE HARDWARE
- UBERLÂNDIA, MG, BRASIL
- PRO. BY
- TITLE:
- DATE OF ISSUE:
- SHEET
- OF
- FILE NAME:
- REV:
- (in symbol U231-091N-1BLRC19-F1) SS
- (in symbol U262-061N-4BVC10) USB TYPE-C
- (in symbol U262-241N-4BV60) USB TYPE-C

## Library data of the parts
1-4 = FURO_M2_DIN7985: Furo para parafuso M2; Part Number: FURO_M2_DIN7985; Nome: FURO_M2_DIN7985; Sub-Tipo: Furo
C1 C4 C6 C9 C12 C16 C19 C32 C37 C41 C44 C47 C49 C53 C56 C60-C63 C66 C69-C72 C75 C83-C87 C90 C92-C95 C103 = CL05B104KO5NNNC: Multilayer Ceramic Capacitors MLCC - SMD/SMT 100nF+/-10% 16V X7R 0402; Manufacter: Samsung Electro-Mechanics; Polarizado/Não polarizado: Não polarizado; Montagem: SMD; Sub-Tipo: Ceramico; Tensão (V): 16; Tolerance (%): 10%; Part Number: CL05B104KO5NNNC; Nome: CL05B104KO5NNNC; Package: 0402; Supplier 1: Mouser; Supplier Part Number 1: 187-CL05B104KO5NNNC; Supplier 2: Digikey; Supplier Part Number 2: CL05B104KO5NNNC; Supplier 3: LCSC; Supplier Part Number 3: C1525
C2 C33 C34 C77-C81 = CL05A106MP5NUNC: Multilayer Ceramic Capacitors MLCC - SMD/SMT 10uF+/-20% 10V X5R 1005; Manufacter: Samsung Electro-Mechanics; Polarizado/Não polarizado: Não polarizado; Montagem: SMD; Sub-Tipo: Ceramico; Tensão (V): 10; Tolerance (%): 20%; Part Number: CL05A106MP5NUNC; Nome: CL05A106MP5NUNC; Package: 0402; Supplier 1: Mouser; Supplier Part Number 1: 187-CL05A106MP5NUNC; Supplier 2: Digikey; Supplier Part Number 2: 1276-1450-1-ND; Supplier 3: LCSC; Supplier Part Number 3: C315248
C3 C5 C13 C52 = CL05A105KP5NNNC: Multilayer Ceramic Capacitors MLCC - SMD/SMT 1uF+/-10% 10V X5R 10 0402; Manufacter: Samsung Electro-Mechanics; Polarizado/Não polarizado: Não polarizado; Montagem: SMD; Sub-Tipo: Ceramico; Tensão (V): 10; Tolerance (%): 10%; Part Number: CL05A105KP5NNNC; Nome: CL05A105KP5NNNC; Package: 0402; Supplier 1: Mouser; Supplier Part Number 1: 187-CL05A105KP5NNNC; Supplier 2: Digikey; Supplier Part Number 2: 1276-1076-1-ND; Supplier 3: LCSC; Supplier Part Number 3: C14445
C7 C10 C14 C17 C30 C35 C39 C42 C45 C50 C57 C76 C91 C102 = CL05B102KB5NNNC: Multilayer Ceramic Capacitors MLCC - SMD/SMT 1nF+/-10% 50V X7R 1005; Manufacter: Samsung Electro-Mechanics; Polarizado/Não polarizado: Não polarizado; Montagem: SMD; Sub-Tipo: Ceramico; Tensão (V): 50; Tolerance (%): 10%; Part Number: CL05B102KB5NNNC; Nome: CL05B102KB5NNNC; Package: 0402; Supplier 1: Mouser; Supplier Part Number 1: 187-CL05B102KB5NNNC; Supplier 2: Digikey; Supplier Part Number 2: 1276-1032-1-ND; Supplier 3: LCSC; Supplier Part Number 3: C14442
C8 C11 C15 C18 C20 C21 C31 C36 C40 C43 C46 = CL05B103KB5NNNC: Multilayer Ceramic Capacitors MLCC - SMD/SMT 10nF+/-10% 50V X7R 1 0402; Manufacter: Samsung Electro-Mechanics; Polarizado/Não polarizado: Não polarizado; Montagem: SMD; Sub-Tipo: Ceramico; Tensão (V): 50; Tolerance (%): 10%; Part Number: CL05B103KB5NNNC; Nome: CL05B103KB5NNNC; Package: 0402; Supplier 1: Mouser; Supplier Part Number 1: 187-CL05B103KB5NNNC; Supplier 2: Digikey; Supplier Part Number 2: 1276-1028-1-ND; Supplier 3: LCSC; Supplier Part Number 3: C15195
C26 C38 C54 C55 C73 C74 C88 C89 C96-C101 = GRM033R61A104KE15D: Multilayer Ceramic Capacitors MLCC - SMD/SMT 0.1 uF 10 VDC 10% 0201 X5R; Manufacter: Murata Electronics; Polarizado/Não polarizado: Não polarizado; Montagem: SMD; Sub-Tipo: Ceramico; Tensão (V): 10; Part Number: GRM033R61A104KE15D; Nome: GRM033R61A104KE15D; Package: 0201; Supplier 1: Mouser; Supplier Part Number 1: GRM033R61A104KE15D; Supplier 2: Digikey; Supplier Part Number 2: 490-5881-1-ND; Supplier 3: LCSC; Supplier Part Number 3: C76934; Tolerance (%): 10%
C48 C51 = CC0402JRNPO9BN180: Multilayer Ceramic Capacitors MLCC - SMD/SMT 50 V 18 pF C0G 0402 5%; Manufacter: YAGEO; Polarizado/Não polarizado: Não polarizado; Montagem: SMD; Sub-Tipo: Ceramico; Tensão (V): 50; Part Number: CC0402JRNPO9BN180; Nome: CC0402JRNPO9BN180; Package: 0402; Supplier 1: Mouser; Supplier Part Number 1: 603-CC402JRNPO9BN180; Tolerance (%): 5%; Supplier 2: Digikey; Supplier Part Number 2: 311-1415-1-ND; Supplier 3: LCSC; Supplier Part Number 3: C106202
C58 C59 C67 C68 C82 = T490A157M004ATE800: Tantalum Capacitors - Solid SMD 4V 150uF 1206 20% ESR=800mOhms; Manufacter: KEMET; Polarizado/Não polarizado: Polarizado; Sub-Tipo: Tântalo; Tensão (V): 20; Part Number: T490A157M004ATE800; Nome: T490A157M004ATE800; Package: A/3216-18; Montagem: SMD; Supplier 1: Mouser; Supplier Part Number 1: 80-T490A157M4ATE800; Supplier 2: Digikey; Supplier Part Number 2: 399-T490A157M004ATE800CT-ND; Supplier 3: LCSC; Supplier Part Number 3: C2798031; Tolerance (%): 20%
D1 D3 D5 D7 D9 D10 = TPD2EUSB30ADRTR: ESD Protection Diodes / TVS Diodes 2 Channel ESD/ Surge Solution; Manufacter: Texas Instruments; Montagem: SMD; Breakdown Voltage: 4.5 V; Peak Pulse Current: 5 A; Peak Pulse Power Dissipation: 45 W; Part Number: TPD2EUSB30ADRTR; Bidirecional/Unidirecional: TPD2EUSB30; Package: DRT_(R-PDSO-N3); Supplier 1: Mouser; Supplier Part Number 1: 595-TPD2EUSB30ADRTR; Supplier 2: Digikey; Supplier Part Number 2: 296-28153-1-ND; Supplier 3: LCSC; Supplier Part Number 3: C94934
D2 D4 D6 D8 D11 D12 = ESD204DQAR: ESD Protection Diodes / TVS Diodes Quad 0.55-pF +/-3.6 -V +/-30-kV ESD pro; Manufacter: Texas Instruments; Montagem: SMD; Breakdown Voltage: 7.9 V; Peak Pulse Current: 5.5 A; Peak Pulse Power Dissipation: 50 W; Part Number: ESD204DQAR; Nome: ESD204DQAR; Bidirecional/Unidirecional: ESD204DQAR; Package: DQA0010A; Supplier 1: Mouser; Supplier Part Number 1: 595-ESD204DQAR; Supplier 2: Digikey; Supplier Part Number 2: 296-49504-1-ND; Supplier 3: LCSC; Supplier Part Number 3: C553132
FB1-FB6 = BLM18KG221SH1D: Ferrite Beads 220 OHM Alternate Sizing Guide Below; Manufacter: Murata Electronics; Corrente Max: 2.2 A; Tolerancia: 25%; Part Number: BLM18KG221SH1D; Nome: BLM18KG221SH1D; Package: 0603; Supplier 1: Mouser; Supplier Part Number 1: 81-BLM18KG221SH1D; Supplier 2: Digikey; Supplier Part Number 2: 490-13256-1-ND; Supplier 3: LCSC; Supplier Part Number 3: C527991; Tipo: Ferrite Bead
J1 = U262-241N-4BV60: USB-C (USB TYPE-C) Receptacle Connector 24 Position Surface Mount; Manufacter: XKB Connection; Montagem: SMD; Colunas: 2; Total de Pinos: 24; Pinos por coluna: 12; Part Number: U262-241N-4BV60; Nome: U262-241N-4BV60; Sub-Tipo: USB; Supplier 3: LCSC; Supplier Part Number 3: C388659
J2-J4 J6 = U231-091N-1BLRC19-F1: USB-A (USB TYPE-A) Receptacle Connector 9 Position Through Hole; Manufacter: XKB Connection; Montagem: SMD; Colunas: 2; Total de Pinos: 9; Pinos por coluna: 4; Part Number: U231-091N-1BLRC19-F1; Nome: U231-091N-1BLRC19-F1; Sub-Tipo: USB; Supplier 3: LCSC; Supplier Part Number 3: C2880601
J5 = U262-061N-4BVC10: USB-C (USB TYPE-C) Receptacle Connector 6 Position Surface Mount; Manufacter: XKB Connection; Montagem: SMD; Colunas: 1; Total de Pinos: 6; Part Number: U262-061N-4BVC10; Nome: U262-061N-4BVC10; Pinos por coluna: 6; Sub-Tipo: USB; Supplier 3: LCSC; Supplier Part Number 3: C692420
LED1-LED4 = XL-1005UBC: LED BLUE WATER CLEAR 0402 SMD; Manufacter: XINGLIGHT; Cor: Azul; Corrente: 20 mA; Tensão: 3.3 V; Part Number: XL-1005UBC; Sub-tipo: LED; Package: 0402; Montagem: SMD; Supplier 2: Digikey; Supplier Part Number 2: 5962-XL-1005UBCTR-ND; Supplier 3: LCSC; Supplier Part Number 3: C22355736
LED5 LED6 = XL-1005SURC: Red 625nm LED Indication - Discrete 1.8V~2.4V 0402; Manufacter: XINGLIGHT; Cor: Vermelho; Corrente: 20 mA; Tensão: 2.4 V; Montagem: SMD; Part Number: XL-1005SURC; Sub-tipo: LED; Package: 0402; Supplier 2: Digikey; Supplier Part Number 2: 5962-XL-1005SURCTR-ND; Supplier 3: LCSC; Supplier Part Number 3: C25503345
R1 = RC0402FR-0790K9L: Thick Film Resistors - SMD General Purpose Chip Resistor 0402, 90.9kOhms, 1%, 1/16W; Manufacter: YAGEO; Potencia: 62.5 mW; Part Number: RC0402FR-0790K9L; Nome: RC0402FR-0790K9L; Package: 0402; Tolerancia: 1%; Montagem: SMD; Supplier 1: Mouser; Supplier Part Number 1: 603-RC0402FR-0790K9L; Supplier 2: Digikey; Supplier Part Number 2: 311-90.9KLRCT-ND; Supplier 3: LCSC; Supplier Part Number 3: C163452; Simbolo: Resistor
R2 R12-R15 R20 R21 R26 R27 = RC0402FR-0710KL: Thick Film Resistors - SMD General Purpose Chip Resistor 0402, 10kOhms, 1%, 1/16W; Manufacter: YAGEO; Potencia: 62.5 mW; Part Number: RC0402FR-0710KL; Nome: RC0402FR-0710KL; Package: 0402; Tolerancia: 1%; Montagem: SMD; Supplier 1: Mouser; Supplier Part Number 1: 603-RC0402FR-0710KL; Supplier 2: Digikey; Supplier Part Number 2: 311-10.0KLRCT-ND; Supplier 3: LCSC; Supplier Part Number 3: C60490; Simbolo: Resistor
R3 = RC0402FR-07200KL: Thick Film Resistors - SMD General Purpose Chip Resistor 0402, 200kOhms, 1%, 1/16W; Manufacter: YAGEO; Potencia: 62.5 mW; Part Number: RC0402FR-07200KL; Nome: RC0402FR-07200KL; Package: 0402; Tolerancia: 1%; Montagem: SMD; Supplier 1: Mouser; Supplier Part Number 1: 603-RC0402FR-07200KL; Supplier 2: Digikey; Supplier Part Number 2: 311-200KLRCT-ND; Supplier 3: LCSC; Supplier Part Number 3: C114763; Simbolo: Resistor
R4 R5 R16 R28 R36 R44 = RC0402FR-071ML: Thick Film Resistors - SMD General Purpose Chip Resistor 0402, 1MOhms, 1%, 1/16W; Manufacter: YAGEO; Potencia: 62.5 mW; Part Number: RC0402FR-071ML; Nome: RC0402FR-071ML; Package: 0402; Tolerancia: 1%; Montagem: SMD; Supplier 1: Mouser; Supplier Part Number 1: 603-RC0402FR-071ML; Supplier 2: Digikey; Supplier Part Number 2: 311-1.00MLRCT-ND; Supplier 3: LCSC; Supplier Part Number 3: C138033; Simbolo: Resistor
R6 = RC0402JR-071KL: Thick Film Resistors - SMD General Purpose Chip Resistor 0402, 1kOhms, 5%, 1/16W; Manufacter: YAGEO; Potencia: 62.5 mW; Part Number: RC0402JR-071KL; Nome: RC0402JR-071KL; Package: 0402; Tolerancia: 5%; Montagem: SMD; Supplier 1: Mouser; Supplier Part Number 1: 603-RC0402JR-071KL; Supplier 2: Digikey; Supplier Part Number 2: 311-1.0KJRCT-ND; Supplier 3: LCSC; Supplier Part Number 3: C105637; Simbolo: Resistor
R7 = RC0402FR-079K53L: Resistores de Filme Fino - SMD 9.53 kOhms 62.5mW 04 02 1%; Manufacter: YAGEO; Part Number: RC0402FR-079K53L; Nome: RC0402FR-079K53L; Potencia: 62.5mW; Package: 0402; Tolerancia: 1%; Montagem: SMD; Supplier 1: Mouser; Supplier Part Number 1: 603-RC0402FR-079K53L; Supplier 2: Digikey; Supplier Part Number 2: 311-9.53KLRCT-ND; Supplier 3: LCSC; Supplier Part Number 3: C295883; Simbolo: Resistor
R8-R11 R19 R41 R42 = RC0402FR-074K7L: Thick Film Resistors - SMD General Purpose Chip Resistor 0402, 4.7kOhms, 1%, 1/16W; Manufacter: YAGEO; Potencia: 62.5 mW; Part Number: RC0402FR-074K7L; Nome: RC0402FR-074K7L; Package: 0402; Tolerancia: 1%; Montagem: SMD; Supplier 1: Mouser; Supplier Part Number 1: 603-RC0402FR-074K7L; Supplier 2: Digikey; Supplier Part Number 2: 311-4.7KLRCT-ND; Supplier 3: LCSC; Supplier Part Number 3: C105871; Simbolo: Resistor
R17 R18 R24 R25 R32 = RC0402FR-0715KL: Thick Film Resistors - SMD General Purpose Chip Resistor 0402, 15kOhms, 1%, 1/16W; Manufacter: YAGEO; Potencia: 62.5 mW; Part Number: RC0402FR-0715KL; Nome: RC0402FR-0715KL; Package: 0402; Tolerancia: 1%; Montagem: SMD; Supplier 1: Mouser; Supplier Part Number 1: 603-RC0402FR-0715KL; Supplier 2: Digikey; Supplier Part Number 2: 311-15.0KLRCT-ND; Supplier 3: LCSC; Supplier Part Number 3: C114761; Simbolo: Resistor
R22 R23 = RC0402FR-075K1L: Thick Film Resistors - SMD General Purpose Chip Resistor 0402, 5.1kOhms, 1%, 1/16W; Manufacter: YAGEO; Potencia: 62.5 mW; Part Number: RC0402FR-075K1L; Nome: RC0402FR-075K1L; Package: 0402; Tolerancia: 1%; Montagem: SMD; Supplier 1: Mouser; Supplier Part Number 1: 603-RC0402FR-075K1L; Supplier 2: Digikey; Supplier Part Number 2: 311-5.10KLRCT-ND; Supplier 3: LCSC; Supplier Part Number 3: C105872; Simbolo: Resistor
R29 = RC0402FR-075K6L: Thick Film Resistors - SMD General Purpose Chip Resistor 0402, 5.6kOhms, 1%, 1/16W; Manufacter: YAGEO; Potencia: 62.5 mW; Part Number: RC0402FR-075K6L; Nome: RC0402FR-075K6L; Package: 0402; Tolerancia: 1%; Montagem: SMD; Supplier 1: Mouser; Supplier Part Number 1: 603-RC0402FR-075K6L; Supplier 2: Digikey; Supplier Part Number 2: 311-5.6KLRCT-ND; Supplier 3: LCSC; Supplier Part Number 3: C163457; Simbolo: Resistor
R30 R31 R33-R35 R37 = RC0402FR-07220RL: Thick Film Resistors - SMD General Purpose Chip Resistor 0402, 220Ohms, 1%, 1/16W; Manufacter: YAGEO; Potencia: 62.5 mW; Part Number: RC0402FR-07220RL; Nome: RC0402FR-07220RL; Package: 0402; Tolerancia: 1%; Montagem: SMD; Supplier 1: Mouser; Supplier Part Number 1: 603-RC0402FR-07220RL; Supplier 2: Digikey; Supplier Part Number 2: 311-220LRCT-ND; Supplier 3: LCSC; Supplier Part Number 3: C112291; Simbolo: Resistor
R43 = CL0805FN900KPS: 900kΩ 125mW 150V Thick Film Resistor ±1% 0805 Chip Resistor - Surface Mount RoHS; Manufacter: CHANGLONG; Montagem: SMD; Part Number: CL0805FN900KPS; Nome: CL0805FN900KPS; Potencia: 125mW; Package: 0805; Tolerancia: 1%; Supplier 3: LCSC; Supplier Part Number 3: C52209984; Simbolo: Resistor
U1 = TUSB8041IRGCR: USB Interface IC TUSB8041 Four-Port U SB 3.0 Hub A 595-TU A 595-TUSB8041IRGCT; Manufacter: Texas Instruments; Montagem: SMD; Sub-Tipo: USB HUB; Part Number: TUSB8041IRGCR; Nome: TUSB8041IRGCR; Package: RGC0064G; Supplier 1: Mouser; Supplier Part Number 1: 595-TUSB8041IRGCR; Supplier 2: Digikey; Supplier Part Number 2: 296-41027-1-ND; Supplier 3: LCSC; Supplier Part Number 3: C544686
U2 U3 U6 U7 = TPS2553DRVR: Power Switch ICs - Power Distribution Adj Crnt-Ltd Pwr- Di st Sw A 595-TPS2553DRVT; Manufacter: Texas Instruments; Montagem: SMD; Sub-Tipo: Current Limiter; Part Number: TPS2553DRVR; Nome: TPS2553DRVR; Package: DRV0006A; Supplier 1: Mouser; Supplier Part Number 1: 595-TPS2553DRVR; Supplier 2: Digikey; Supplier Part Number 2: 296-36006-1-ND; Supplier 3: LCSC; Supplier Part Number 3: C138719
U4 = TXU0101DBVR: Translation - Voltage Levels Single channel fixed -direction level sh; Manufacter: Texas Instruments; Montagem: SMD; Sub-Tipo: Voltage Level Shifter; Part Number: TXU0101DBVR; Nome: TXU0101DBVR; Package: DBV0006A; Supplier 1: Mouser; Supplier Part Number 1: 595-TXU0101DBVR; Supplier 2: Digikey; Supplier Part Number 2: 296-TXU0101DBVRCT-ND; Supplier 3: LCSC; Supplier Part Number 3: C7136368
U5 = TPS2117DRLR: Power Switch ICs - Power Distribution 1.6-V to 5.5-V 20-m ? 4-A low IQ power; Manufacter: Texas Instruments; Montagem: SMD; Sub-Tipo: Power MUX; Part Number: TPS2117DRLR; Nome: TPS2117DRLR; Package: DRL0008A; Supplier 1: Mouser; Supplier Part Number 1: 595-TPS2117DRLR; Supplier 2: Digikey; Supplier Part Number 2: 296-TPS2117DRLRCT-ND; Supplier 3: LCSC; Supplier Part Number 3: C22399676
U8 = TPS74801RGWR: Regulador LDO 1.5A Adj 0.8 to 3.3V; Manufacter: Texas Instruments; Montagem: SMD; Part Number: TPS74801RGWR; Nome: TPS74801RGWR; Package: RGW0020A; Sub-Tipo: Regulador LDO; Supplier 1: Mouser; Supplier Part Number 1: 595-TPS74801RGWR; Supplier 2: Digikey; Supplier Part Number 2: 296-21977-1-ND; Supplier 3: LCSC; Supplier Part Number 3: C129193
U10 = TPS7A4533KTTR: LDO Voltage Regulators Low-Noise Fast Trans -Resp 1.5A; Manufacter: Texas Instruments; Montagem: SMD; Sub-Tipo: Regulador LDO; Part Number: TPS7A4533KTTR; Nome: TPS7A4533KTTR; Package: R-PSFM-G5; Supplier 1: Mouser; Supplier Part Number 1: 595-TPS7A4533KTTR; Supplier 2: Digikey; Supplier Part Number 2: 296-23755-1-ND; Supplier 3: LCSC; Supplier Part Number 3: C2865625
U11 = HD3SS3220IRNHR: USB Interface IC 10-Gbps USB 3.1 Type -C 2:1 mux with DRP A 595-HD3SS3220IRNHT; Manufacter: Texas Instruments; Montagem: SMD; Sub-Tipo: USB MUX; Part Number: HD3SS3220IRNHR; Nome: HD3SS3220IRNHR; Package: RNH0030A; Supplier 1: Mouser; Supplier Part Number 1: 595-HD3SS3220IRNHR; Supplier 2: Digikey; Supplier Part Number 2: 296-51123-1-ND; Supplier 3: LCSC; Supplier Part Number 3: C701817
Y1 = ECS-240-20-30B-TR: Cristais 24MHz 20pF 30 Ohms 4-SMD; Manufacter: ECS; MF: ECS Inc.; Montagem: SMD; SnapEDA_Link: https://www.snapeda.com/parts/ECS-240-20-30B-TR/ECS+Inc./view-part/?ref=snap; Package: SMD-4 ECS International; Value: 24MHz; MP: ECS-240-20-30B-TR; Check_prices: https://www.snapeda.com/parts/ECS-240-20-30B-TR/ECS+Inc./view-part/?ref=eda; Part Number: ECS-240-20-30B-TR; Nome: ECS-240-20-30B-TR; Cap de Carga: 20pF; Supplier 1: Mouser; Supplier Part Number 1: 520-ECS-240-20-30B; Supplier 2: Digikey; Supplier Part Number 2: XC1122CT-ND; Supplier 3: LCSC; Supplier Part Number 3: C2450113